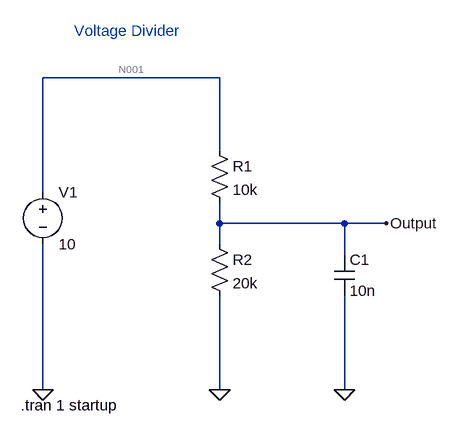
[diagram p0: schematic Voltage Divider.asc]
Voltage Divider.asc, the LTspice schematic file:
Version 4
SHEET 1 880 680
WIRE 240 0 -32 0
WIRE 240 112 240 0
WIRE -32 176 -32 0
WIRE 240 224 240 192
WIRE 432 224 240 224
WIRE 496 224 432 224
WIRE 240 256 240 224
WIRE 432 272 432 224
WIRE -32 480 -32 256
WIRE 240 480 240 336
WIRE 432 480 432 336
FLAG -32 480 0
FLAG 240 480 0
FLAG 496 224 Output
FLAG 432 480 0
SYMBOL res 224 96 R0
SYMATTR InstName R1
SYMATTR Value 10k
SYMBOL res 224 240 R0
SYMATTR InstName R2
SYMATTR Value 20k
SYMBOL voltage -32 160 R0
WINDOW 123 0 0 Left 0
WINDOW 39 0 0 Left 0
SYMATTR InstName V1
SYMATTR Value 10
SYMBOL cap 416 272 R0
SYMATTR InstName C1
SYMATTR Value 10n
TEXT 16 -72 Left 2 ;Voltage Divider
TEXT -66 504 Left 2 !.tran 1 startup

The netlist it stands for:
* Voltage Divider.asc
R1 N001 Output 10k
R2 Output 0 20k
V1 N001 0 10
C1 Output 0 10n
* Voltage Divider
.tran 1 startup
.backanno
.end

* Results of the author's LTspice run, read from the files saved beside the schematic
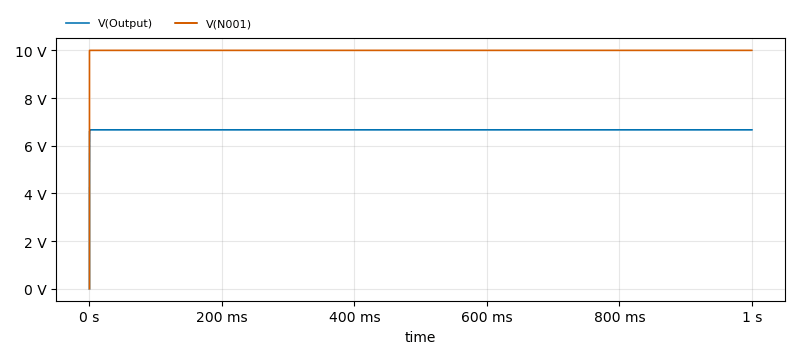
[diagram p1: Transient Analysis of Voltage Divider.asc, plotted from the saved traces]
* Transient Analysis, 1 run:
*   V(Output): min 0 V, max 6.667 V, average 6.666 V, rms 6.666 V, last 6.667 V
*   V(N001): min 0 V, max 10 V, average 10 V, rms 10 V, last 10 V